# EAGLE schematic MainBoard (EAGLE 9.2.2)
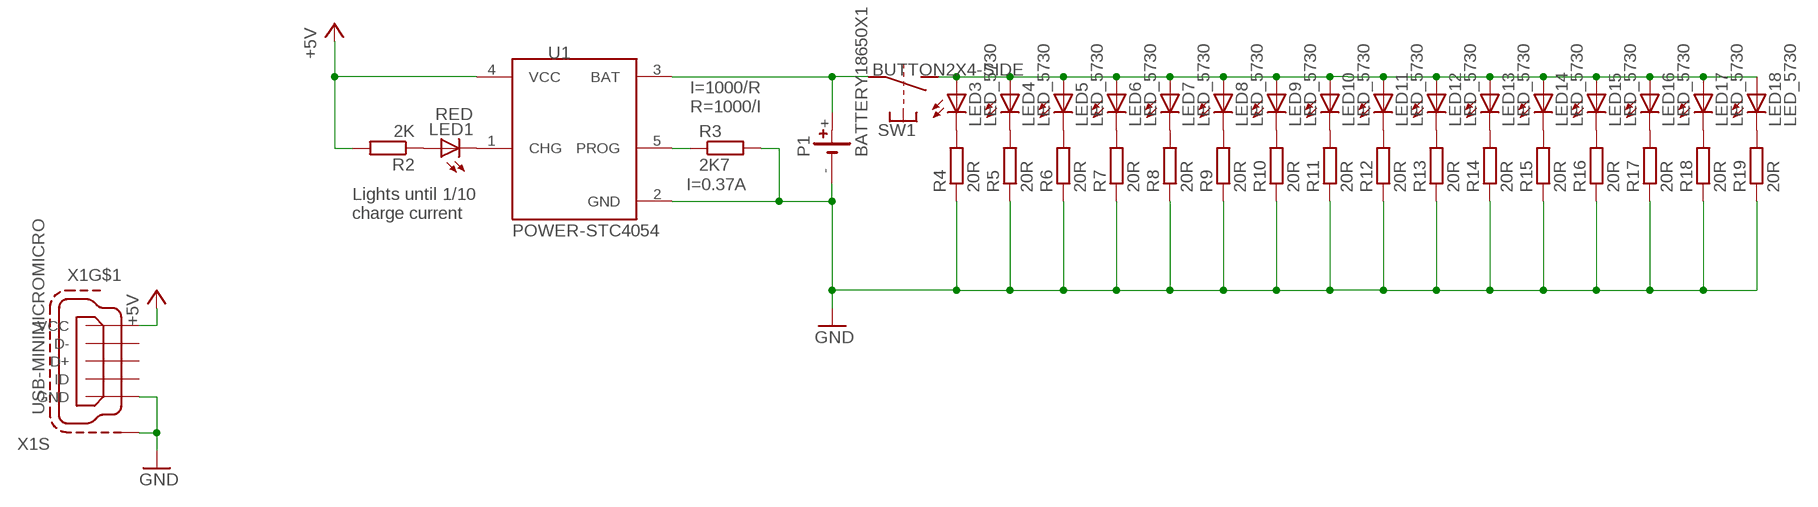
[diagram p0: schematic, sheet 1]

## Parts
LED1  RED  LED_1206  [LED1206]
LED3  LED_5730  [LED5730]
LED4  LED_5730  [LED5730]
LED5  LED_5730  [LED5730]
LED6  LED_5730  [LED5730]
LED7  LED_5730  [LED5730]
LED8  LED_5730  [LED5730]
LED9  LED_5730  [LED5730]
LED10  LED_5730  [LED5730]
LED11  LED_5730  [LED5730]
LED12  LED_5730  [LED5730]
LED13  LED_5730  [LED5730]
LED14  LED_5730  [LED5730]
LED15  LED_5730  [LED5730]
LED16  LED_5730  [LED5730]
LED17  LED_5730  [LED5730]
LED18  LED_5730  [LED5730]
P1  BATTERY18650X1  [18650X1_HOLDER]
R2  2K  R_R0805  [RESC2012X50]
R3  2K7  R_R0805  [RESC2012X50]
R4  20R  R_R0805  [RESC2012X50]
R5  20R  R_R0805  [RESC2012X50]
R6  20R  R_R0805  [RESC2012X50]
R7  20R  R_R0805  [RESC2012X50]
R8  20R  R_R0805  [RESC2012X50]
R9  20R  R_R0805  [RESC2012X50]
R10  20R  R_R0805  [RESC2012X50]
R11  20R  R_R0805  [RESC2012X50]
R12  20R  R_R0805  [RESC2012X50]
R13  20R  R_R0805  [RESC2012X50]
R14  20R  R_R0805  [RESC2012X50]
R15  20R  R_R0805  [RESC2012X50]
R16  20R  R_R0805  [RESC2012X50]
R17  20R  R_R0805  [RESC2012X50]
R18  20R  R_R0805  [RESC2012X50]
R19  20R  R_R0805  [RESC2012X50]
SW1  BUTTON2X4-SIDE  [SW-2X4-SIDE]
U1  POWER-STC4054  [SOT95P280X145-5]
X1  USB-MINIMICROMICRO  [USB-B-MICRO-SMD]

## Nets
+5V: R2.2 U1.4(VCC) X1.VBUS(VCC)
GND: P1.- R3.2 R4.1 R5.1 R6.1 R7.1 R8.1 R9.1 R10.1 R11.1 R12.1 R13.1 R14.1 R15.1 R16.1 R17.1 R18.1 R19.1 U1.2(GND) X1.GND X1.SHIELD1(S:S1) X1.SHIELD2(S:S1) X1.SHIELD3(S:S1)
N$1: LED1.C U1.1(CHG)
N$2: LED1.A R2.1
N$5: R3.1 U1.5(PROG)
N$6: LED3.C R4.2
N$9: LED4.C R5.2
N$10: LED5.C R6.2
N$11: LED6.C R7.2
N$12: LED7.C R8.2
N$13: LED8.C R9.2
N$14: LED9.C R10.2
N$15: LED10.C R11.2
N$16: LED11.C R12.2
N$17: LED12.C R13.2
N$18: LED13.C R14.2
N$19: LED14.C R15.2
N$20: LED15.C R16.2
N$21: LED16.C R17.2
N$22: LED17.C R18.2
N$23: LED18.C R19.2
N$24: P1.+ SW1.1 U1.3(BAT)
N$84: LED3.A LED3.A1(A) LED4.A LED4.A1(A) LED5.A LED5.A1(A) LED6.A LED6.A1(A) LED7.A LED7.A1(A) LED8.A LED8.A1(A) LED9.A LED9.A1(A) LED10.A LED10.A1(A) LED11.A LED11.A1(A) LED12.A LED12.A1(A) LED13.A LED13.A1(A) LED14.A LED14.A1(A) LED15.A LED15.A1(A) LED16.A LED16.A1(A) LED17.A LED17.A1(A) LED18.A LED18.A1(A) SW1.2
Unconnected: X1.D+ X1.D- X1.ID

## Notes on the sheet
- I=1000/R
  R=1000/I
- I=0.37A
- Lights until 1/10
  charge current

## Library data of the parts
LED1 LED3-LED18 = Flamberm:LED_
P1 = Flamberm:BATTERY
R2-R19 = Flamberm:R_
SW1 = Flamberm:BUTTON
U1 = Flamberm:POWER-STC4054
X1 = Flamberm:USB-MINIMICRO: MINI USB-B Conector Source: www.cypressindustries.com